# Altium schematic sheet Battery Monitoring.SchDoc
size A4; Author1: Russell MacGregor; VersionControl_Repository: BatteryMonitorSpring2025; Organization: Machine Intellgence Laboratory; Des1: This IC monitors the voltage; Des2: of the battery and the current; Des3: drawn from it.; SheetNumber: 3; SheetTotal: 5
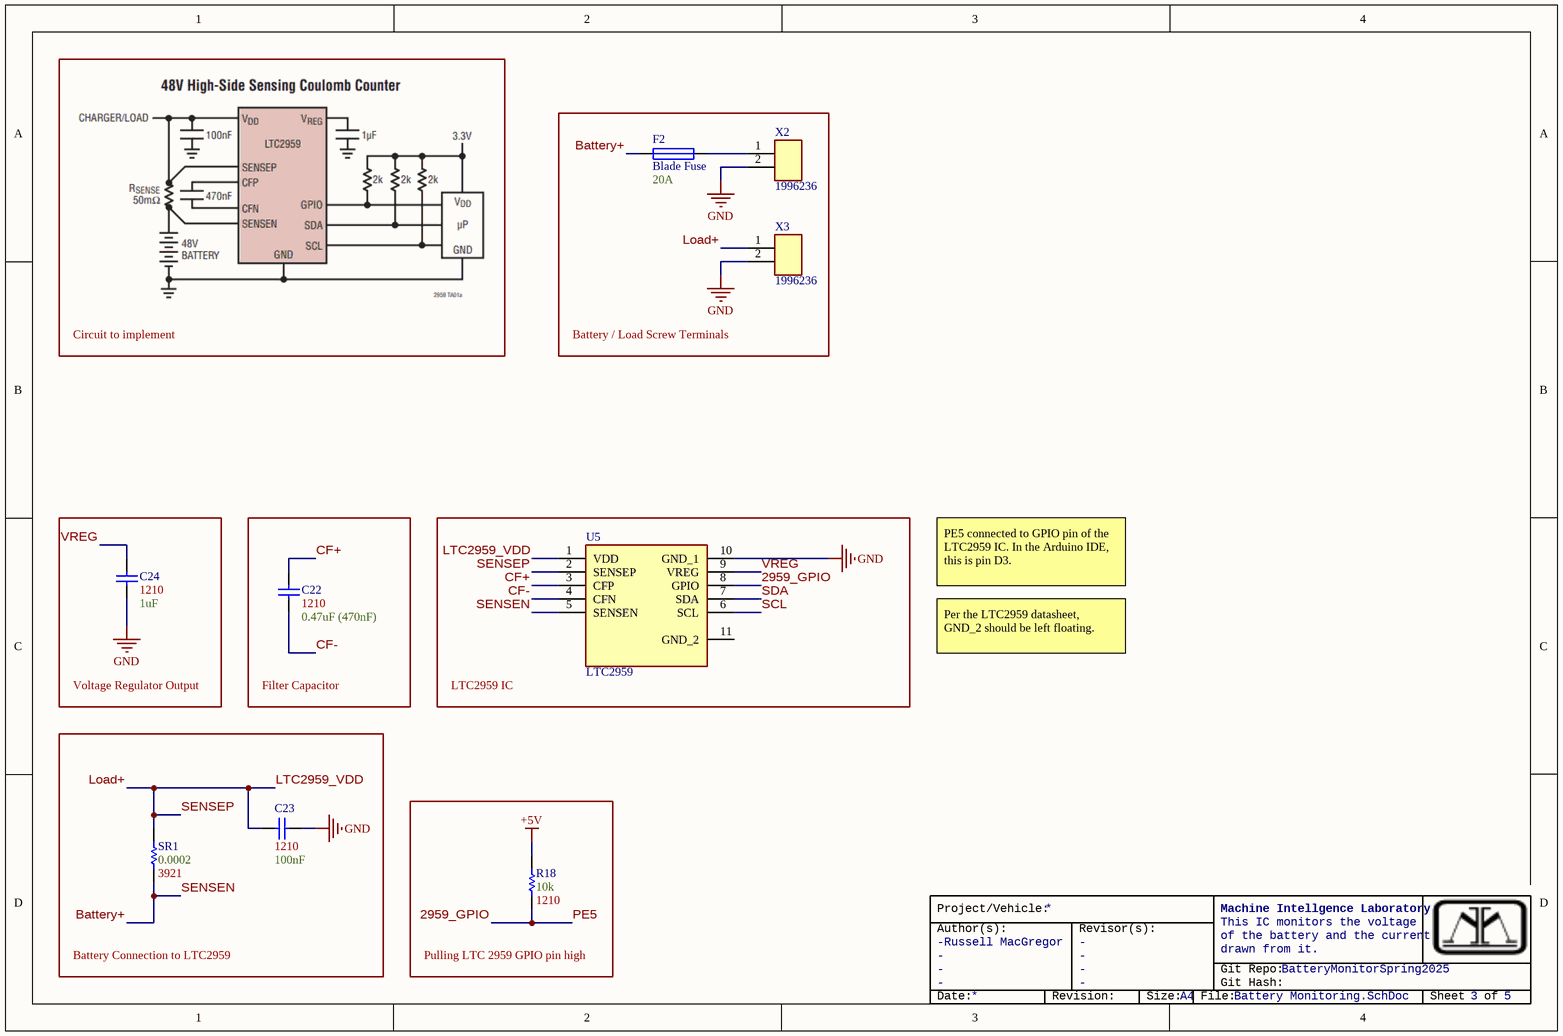
[diagram p0: Battery Monitoring.SchDoc]

## Parts
C22  Size Package: 1210  Capacitance: 0.47uF (470nF)  [SMD Capacitor [1210]]  (hidden comment: SMD Cap - Nonpolarized)
C23  Size Package: 1210  Capacitance: 100nF  [SMD Capacitor [1210]]  (hidden comment: SMD Cap - Nonpolarized)
C24  Size Package: 1210  Capacitance: 1uF  [SMD Capacitor [1210]]  (hidden comment: SMD Cap - Nonpolarized)
F2  Blade Fuse  Capacity: 20A  [Blade Fuse [2]]
R18  Resistance: 10k  Size Package: 1210  [SMD Resistor [1210]]  (hidden comment: SMD Resistor)
SR1  Resistance: 0.0002  Size Package: 3921  [SMD Resistor [3921]]  (hidden comment: SMD Resistor)
U5  LTC2959  [Battery Monitor IC]
X2  1996236  [Screw Terminal [1996236]]
X3  1996236  [Screw Terminal [1996236]]

## Blocks framed on the sheet
Battery / Load Screw Terminals: F2 X2 X3
Voltage Regulator Output: C24
Filter Capacitor: C22
LTC2959 IC: U5
Battery Connection to LTC2959: C23 SR1
Pulling LTC 2959 GPIO pin high: R18

## Nets
+5V: R18.1
GND: C23.1 C24.2 U5.10(GND_1) X2.2 X3.2
2959_GPIO: R18.2 U5.8(GPIO)  [also labelled PE5]
Battery+: F2.1 SR1.1 U5.5(SENSEN)  [also labelled SENSEN]
CF+: C22.1 U5.3(CFP)
CF-: C22.2 U5.4(CFN)
Load+: C23.2 SR1.2 U5.1(VDD) U5.2(SENSEP) X3.1  [also labelled LTC2959_VDD, SENSEP]
SCL: U5.6(SCL)
SDA: U5.7(SDA)
VREG: C24.1 U5.9(VREG)
NetF2_2: F2.2 X2.1

Not connected (* = marked no-connect by the designer): U5 11(GND_2)

## Notes on the sheet
- Circuit to implement
- PE5 connected to GPIO pin of the LTC2959 IC. In the Arduino IDE, this is pin D3.
- Per the LTC2959 datasheet, GND_2 should be left floating.
- Project/Vehicle:
- Author(s):
- -
- Revisor(s):
- Git Repo:
- Git Hash:
- Date:
- Revision:
- Size:
- A4
- File:
- Sheet
- of

## Library data of the parts
F2 = Blade Fuse: Standard Fuse Socket; Mouser Part #: 576-178.6165.0002
R18 = SMD Resistor: JLC Part #: C728401 / (for 1M Ohm Res); Mouser Part #: 71-CRCW121010K0JNAIF
U5 = LTC2959 Battery Monitor IC: Mouser Part #: 584-LTC2959IDDBTRMPB
X2 X3 = Screw Terminal [1996236]: Mouser Part #: 651-1996236
C22-C24 = SMD Cap - Nonpolarized: JLC Part #: *
  C22: Mouser Part #: 80-C1210C474K1RAUTO
  C23: Mouser Part #: 581-12107C104KAT2A
  C24: Mouser Part #: 80-C1210X105K5RAUTO
SR1 = SMD Resistor: JLC Part #: C728401; Mouser Part #: 71-WSL3921L2000FEA